# EAGLE design USBasp (EAGLE 7.7.0)
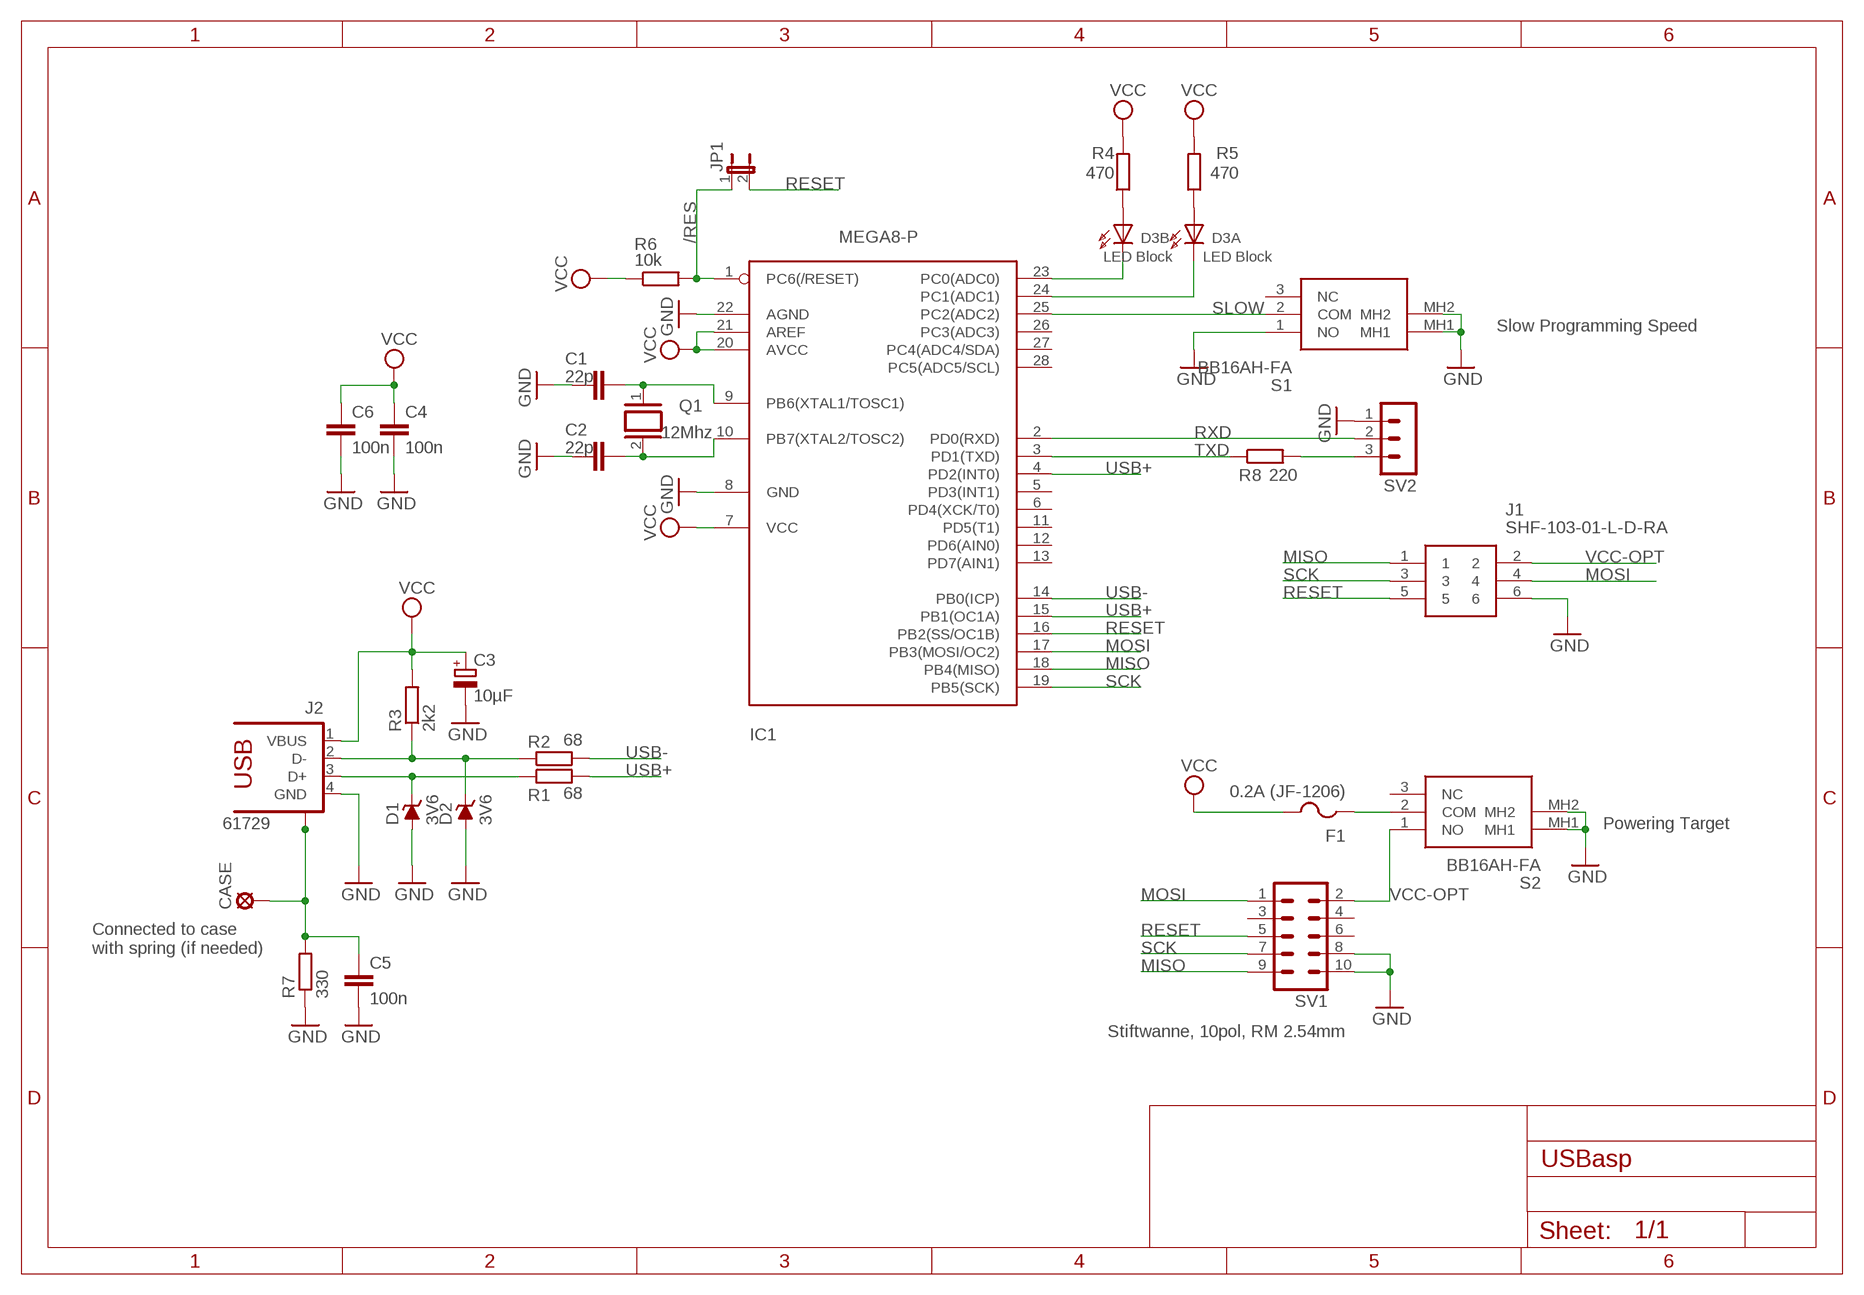
[diagram p0: schematic, sheet 1]

## Parts
C1  22p  C-EU025-024X044  [C025-024X044]
C2  22p  C-EU025-024X044  [C025-024X044]
C3  10µF  CPOL-EUE2.5-6  [E2,5-6]
C4  100n  C-EU050-024X044  [C050-024X044]
C5  100n  C-EU050-024X044  [C050-024X044]
C6  100n  C-EU050-024X044  [C050-024X044]
CASE  LSP10  [LSP10]
D1  3V6  BZX55  [DO35Z10]
D2  3V6  BZX55  [DO35Z10]
D3  LED Block  1801_PINS_SWAPPED  [1801_PINS_SWAPPED]
F1  0.2A (JF-1206)  PTCFUSE-1206  [R1206]
IC1  MEGA8-P  [DIL28-3]
J1  SHF-103-01-L-D-RA  [SHF10301LDRA]
J2  61729  [61729]
JP1  JP1E  [JP1]
Q1  12Mhz  XTAL/S  [QS]
R1  68  R-EU_0207/10  [0207/10]
R2  68  R-EU_0207/10  [0207/10]
R3  2k2  R-EU_0207/10  [0207/10]
R4  470  R-EU_0207/10  [0207/10]
R5  470  R-EU_0207/10  [0207/10]
R6  10k  R-EU_0207/10  [0207/10]
R7  330  R-EU_0207/10  [0207/10]
R8  220  R-EU_R0805  [R0805]
S1  BB16AH-FA  [BB16AHFA]
S2  BB16AH-FA  [BB16AHFA]
SV1  Stiftwanne, 10pol, RM 2.54mm  ML10L  [ML10L]
SV2  MA03-1  [MA03-1]

## Nets
/RES: IC1.1(PC6(/RESET)) JP1.1 R6.2
GND: C1.1 C2.1 C3.- C4.2 C5.2 C6.2 D1.A D2.A IC1.8(GND) IC1.22(AGND) J1.6 J2.4(GND) R7.1 S1.1(NO) S1.MH1 S1.MH2 S2.MH1 S2.MH2 SV1.8 SV1.10 SV2.1
MISO: IC1.18(PB4(MISO)) J1.1 SV1.9
MOSI: IC1.17(PB3(MOSI/OC2)) J1.4 SV1.1
N$1: D3.A1(B:A) R4.1
N$2: C5.1 CASE.MP J2.S1 J2.S2 R7.2
N$3: C1.2 IC1.9(PB6(XTAL1/TOSC1)) Q1.1
N$4: C2.2 IC1.10(PB7(XTAL2/TOSC2)) Q1.2
N$5: D1.C J2.3(D+) R1.1
N$6: D2.C J2.2(D-) R2.1 R3.1
N$7: D3.A(A:A) R5.1
N$9: D3.K1(B:K) IC1.23(PC0(ADC0))
N$10: D3.K(A:K) IC1.24(PC1(ADC1))
N$12: F1.1 S2.2(COM)
N$18: R8.2 SV2.3
RESET: IC1.16(PB2(SS/OC1B)) J1.5 JP1.2 SV1.5
RXD: IC1.2(PD0(RXD)) SV2.2
SCK: IC1.19(PB5(SCK)) J1.3 SV1.7
SLOW: IC1.25(PC2(ADC2)) S1.2(COM)
TXD: IC1.3(PD1(TXD)) R8.1
USB+: IC1.4(PD2(INT0)) IC1.15(PB1(OC1A)) R1.2
USB-: IC1.14(PB0(ICP)) R2.2
VCC: C3.+ C4.1 C6.1 F1.2 IC1.7(VCC) IC1.20(AVCC) IC1.21(AREF) J2.1(VBUS) R3.2 R4.2 R5.2 R6.1
VCC-OPT: J1.2 S2.1(NO) SV1.2
Unconnected: IC1.5(PD3(INT1)) IC1.6(PD4(XCK/T0)) IC1.11(PD5(T1)) IC1.12(PD6(AIN0)) IC1.13(PD7(AIN1)) IC1.26(PC3(ADC3)) IC1.27(PC4(ADC4/SDA)) IC1.28(PC5(ADC5/SCL)) S1.3(NC) S2.3(NC) SV1.3 SV1.4 SV1.6

## Notes on the sheet
- Slow Programming Speed
- Powering Target
- Connected to case 
  with spring (if needed)

## Library data of the parts
C1 C2 C4-C6 = rcl:C-EU: CAPACITOR, European symbol
C3 = rcl:CPOL-EU: POLARIZED CAPACITOR, European symbol
CASE = solpad:LSP10: SOLDER PAD drill 1.0 mm, distributor Buerklin, 12H555
D1 D2 = diode:BZX55: Z DIODE
D3 = Mentor-FEL:1801_PINS_SWAPPED: Similar to 1801 but with Pins Anode/Kathode swapped.
F1 = adafruit:PTCFUSE: PTC fuses, resettable thermistors
IC1 = avr-1:MEGA8-P: MICROCONTROLLER 8 Kbytes FLASH 1 kbytes SRAM 512 bytes EEPROM USART 4-channel 10 bit ADC 2-channel 8 bit ADC
J1 = SamacSys_Parts:SHF-103-01-L-D-RA: CONN HEADER R/A 6POS 1.27MM Source: Datasheet <http://suddendocs.samtec.com/catalog_english/shf.pdf>; DESCRIPTION: CONN HEADER R/A 6POS 1.27MM; HEIGHT: 5.59mm; MANUFACTURER_NAME: SAMTEC; MANUFACTURER_PART_NUMBER: SHF-103-01-L-D-RA
J2 = con-usb:61729: TYPE-B Receptacle, FCI
JP1 = jumper:JP1E: JUMPER
Q1 = special:XTAL/S: CRYSTAL
R1-R8 = rcl:R-EU_: RESISTOR, European symbol
S1 S2 = SamacSys_Parts:BB16AH-FA: Pushbutton Switches ON-ON .201 BLACK CAP RIGHT ANGL PC .4VA Source: Datasheet <https://www.arrow.com/en/products/bb16ah-fa/nkk-switches>; DESCRIPTION: Pushbutton Switches ON-ON .201 BLACK CAP RIGHT ANGL PC .4VA; HEIGHT: 8.8mm; MANUFACTURER_NAME: NKK Switches; MANUFACTURER_PART_NUMBER: BB16AH-FA; MOUSER_PART_NUMBER: 633-BB16AH-FA; MOUSER_PRICE-STOCK: https://www.mouser.co.uk/ProductDetail/NKK-Switches/BB16AH-FA?qs=E3XkhTW0K2HrJGK%2FHHAprQ%3D%3D
SV1 = con-ml:ML10L: HARTING; OC_FARNELL: unknown; OC_NEWARK: unknown
SV2 = con-lstb:MA03-1: PIN HEADER; OC_FARNELL: unknown; OC_NEWARK: unknown

## Net classes
0 default: width 0.406 mm, clearance 0.127 mm

## Board
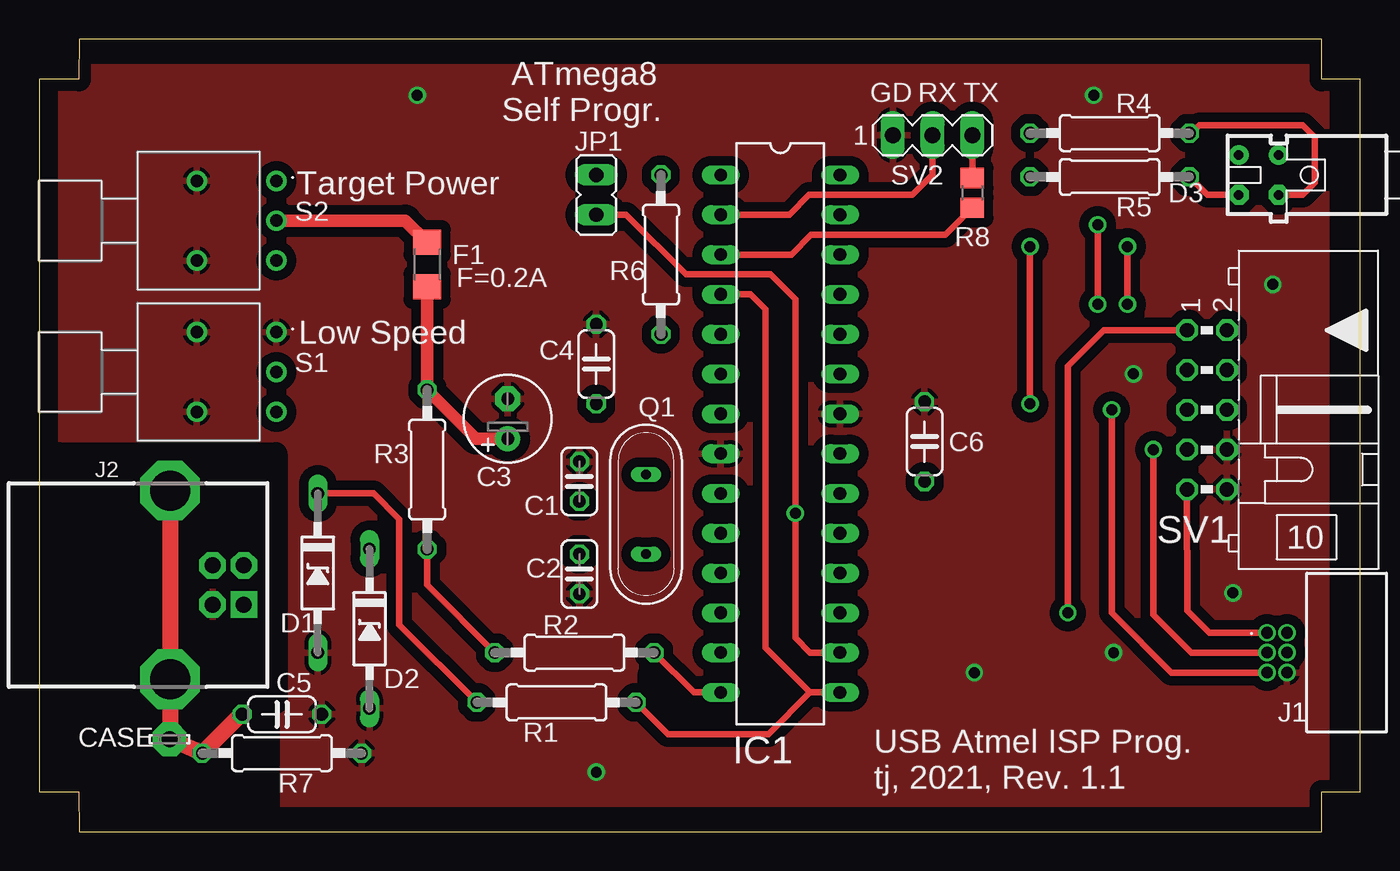
[diagram p1: board, top side]
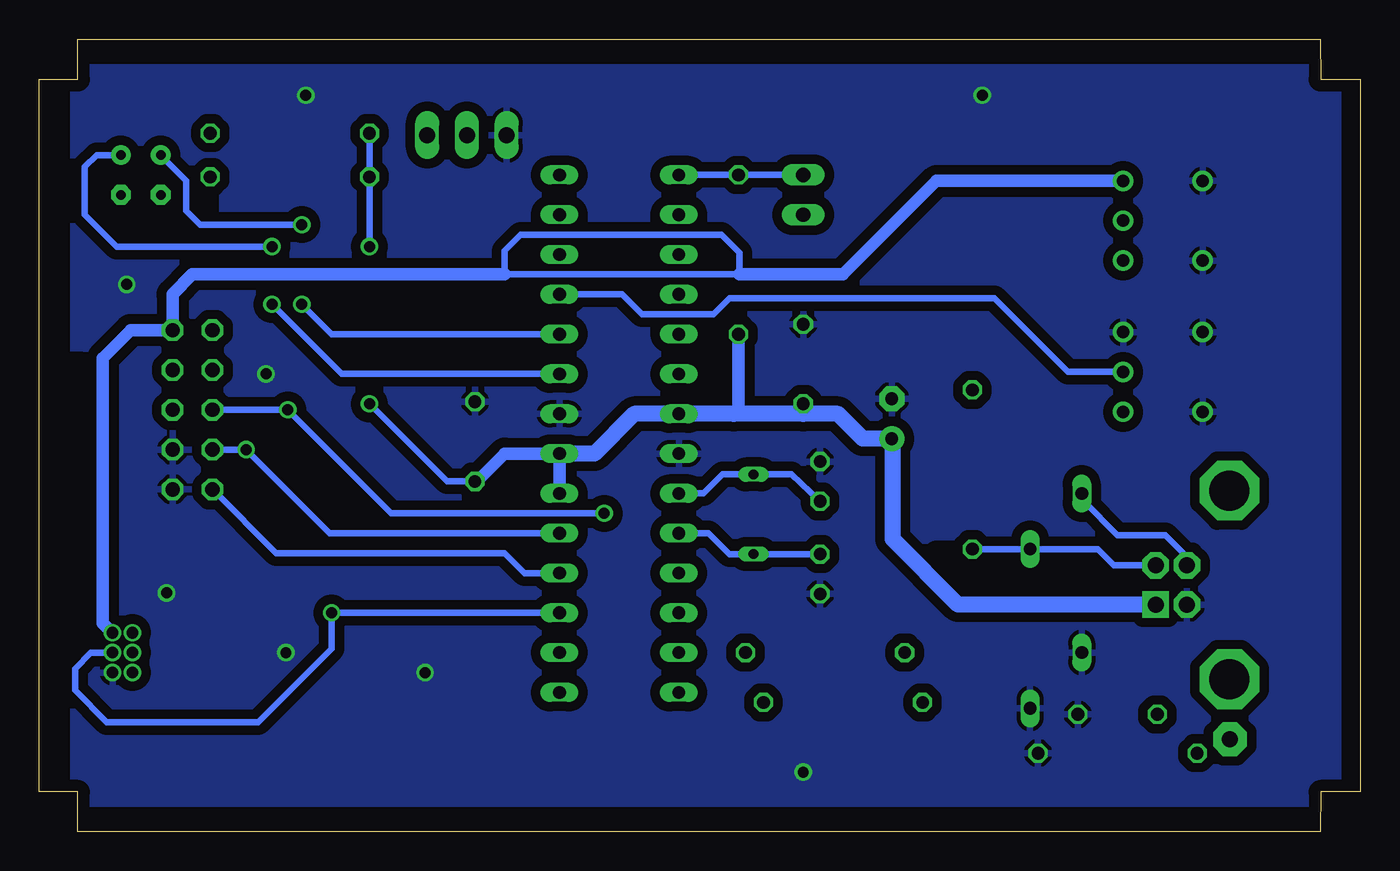
[diagram p2: board, bottom side, seen from below]

Size 84.33 x 50.57 mm. Coordinates in mm from the lower left corner, seen from the top.
Outline: 2.54,0 81.86,0 81.86,2.54 84.33,2.54 84.33,48.01 81.86,48.01 81.86,50.57 2.54,50.57 2.54,48.01 0,48.01 0,2.54 2.54,2.54 2.54,0
Copper layers (1*16): Top 0.035mm / dielectric 1.5mm / Bottom 0.035mm
Design rules "default *": minimum track width 16mil, minimum drill 24mil, track to track 8mil, track to pad 8mil, pad to pad 5mil, via to via 8mil, smd to smd 8mil, copper to edge 30mil, drill to drill 8mil, minimum pad ring 7mil, minimum via ring 8mil, stop-mask expansion 4mil, vias tented up to drill 12mil, thermal gap 10mil
tRestrict: 9 lines
bRestrict: 3 lines

### Footprints (pad centres in the part's own frame; a part is rotated, then mirrored left to right if it is on the bottom)
C025-024X044 = drill 0.813 octagon: 1 -1.27,0; 2 1.27,0
E2,5-6 = drill 0.813 pad 1.6: + -1.27,0 | drill 0.813 pad 1.6 octagon: - 1.27,0
C050-024X044 = drill 0.813 octagon: 1 -2.54,0; 2 2.54,0
LSP10 = drill 1.016 pad 2.159 octagon: MP 0,0
DO35Z10 = drill 0.813 long: A 5.08,0; C -5.08,0
1801_PINS_SWAPPED = drill 0.61 pad 1.27 octagon: A 2.54,1.27; A1 0,1.27 | drill 0.61 pad 1.27: K 2.54,-1.27; K1 0,-1.27
R1206 = smd 1.6 x 1.803: 1 -1.422,0; 2 1.422,0
DIL28-3 = drill 0.813 long: 1 -16.51,-3.81; 2 -13.97,-3.81; 3 -11.43,-3.81; 4 -8.89,-3.81; 5 -6.35,-3.81; 6 -3.81,-3.81; 7 -1.27,-3.81; 8 1.27,-3.81; 9 3.81,-3.81; 10 6.35,-3.81; 11 8.89,-3.81; 12 11.43,-3.81; 13 13.97,-3.81; 14 16.51,-3.81; 15 16.51,3.81; 16 13.97,3.81; 17 11.43,3.81; 18 8.89,3.81; 19 6.35,3.81; 20 3.81,3.81; 21 1.27,3.81; 22 -1.27,3.81; 23 -3.81,3.81; 24 -6.35,3.81; 25 -8.89,3.81; 26 -11.43,3.81; 27 -13.97,3.81; 28 -16.51,3.81
SHF10301LDRA = drill 0.74 pad 1.1: 1 0,0; 2 0,1.27; 3 1.27,0; 4 1.27,1.27; 5 2.54,0; 6 2.54,1.27
61729 = drill 1.016 pad 1.676 square: 1 1.25,1 | drill 1.016 pad 1.676 octagon: 2 -1.25,1; 3 -1.25,-1; 4 1.25,-1 | drill 2.54 pad 3.81 octagon: S1 -6.02,-3.71; S2 6.02,-3.71
JP1 = drill 0.914 long: 1 0,-1.27; 2 0,1.27
QS = drill 0.61 long: 1 -2.54,0; 2 2.54,0
0207/10 = drill 0.813 octagon: 1 -5.08,0; 2 5.08,0
R0805 = smd 1.3 x 1.5: 1 -0.95,0; 2 0.95,0
BB16AHFA = drill 0.8 pad 1.3: 1 0,0; 2 2.54,0; 3 5.08,0; MH1 0,-5.08; MH2 5.08,-5.08
ML10L = drill 0.914 octagon: 1 -5.08,-1.27; 2 -5.08,1.27; 3 -2.54,-1.27; 4 -2.54,1.27; 5 0,-1.27; 6 0,1.27; 7 2.54,-1.27; 8 2.54,1.27; 9 5.08,-1.27; 10 5.08,1.27
MA03-1 = drill 1.016 long: 1 -2.54,0; 2 0,0; 3 2.54,0

### Placement (x,y rotation side)
C1  34.48,22.35 270 top
C2  34.48,16.45 90 top
C3  29.91,26.35 90 top
C4  35.56,29.84 90 top
C5  15.49,7.49 0 top
C6  56.52,24.89 90 top
CASE  8.32,5.91 0 top
D1  17.78,16.51 270 top
D2  21.08,12.95 270 top
D3  79.11,41.91 180 top
F1  24.77,36.2 270 top
IC1  47.31,25.4 270 top
J1  78.38,12.7 270 top
J2  12.06,15.75 270 top
JP1  35.56,40.64 180 top
Q1  38.73,20.26 270 top
R1  33.02,8.26 0 top
R2  34.16,11.43 0 top
R3  24.77,23.11 90 top
R4  68.33,44.58 180 top
R5  68.33,41.78 180 top
R6  39.69,36.83 90 top
R7  15.49,5.02 180 top
R8  59.56,40.77 90 top
S1  15.14,31.88 270 top
S2  15.14,41.53 270 top
SV1  74.54,26.92 270 top
SV2  57.02,44.45 0 top

### Tracks (layer width: path | path; a pad name or v marks a point on that pad's centre or on a via)
/RES
  Bottom 0.406: IC1.1 R6.2 JP1.1
GND  (via drill 0.7)
  other vias: 59.69,10.16 68.58,11.43 69.85,29.21 67.31,46.99 78.74,34.92 24.13,46.99 76.2,15.24 35.56,3.81
  pour Bottom (isolate 0.61): 1.4,48.77 82.17,48.77 82.17,1.78 1.4,1.78
  pour Top (isolate 0.61): 1.4,48.77 1.4,1.78 82.17,1.78 82.17,48.77
MISO
  Top 0.406: J1.1 74.68,12.7 73.28,14.1 SV1.9
  Bottom 0.406: IC1.18 53.34,16.51 54.61,17.78 69.22,17.78 SV1.9
MOSI  (via drill 0.7)
  Top 0.406: v65.66,13.97 65.66,29.72 67.94,32 SV1.1
  Bottom 0.406: IC1.17 v65.66,13.97 65.66,11.68 70.36,6.99 80.01,6.99 82.04,9.02 82.04,10.41 81.03,11.43 J1.4
N$1
  Top 0.406: R4.1 73.53,44.58 74.04,45.09 80.64,45.09 81.41,44.32 81.41,41.4 80.64,40.64 D3.A1
N$2
  Top 1.016: J2.S1 J2.S2 8.36,6.2 CASE.MP R7.2 12.89,7.49 C5.1
N$3
  Bottom 0.406: IC1.9 41.91,21.59 40.7,22.8 Q1.1 36.32,22.8 C1.2
N$4
  Bottom 0.406: C2.2 Q1.2 40.26,17.72 41.59,19.05 IC1.10
N$5
  Top 0.406: D1.C 21.34,21.59 22.99,19.94 22.99,13.21 R1.1
  Bottom 0.406: J2.3 11.06,17.54 12.45,18.92 15.49,18.92 17.65,21.08 D1.C
N$6
  Top 0.406: R3.1 24.77,15.75 R2.1
  Bottom 0.406: R3.1 D2.C 16.76,18.03 15.75,17.02 12.96,17.02 J2.2
N$7
  Top 0.406: R5.1 74.55,40.64 D3.A
N$9  (via drill 0.7)
  Top 0.406: v69.47,33.66 v69.47,37.34
  Bottom 0.406: IC1.23 65.02,29.21 v69.47,33.66 | v69.47,37.34 79.38,37.34 81.41,39.37 81.41,42.42 80.64,43.18 D3.K1
N$10  (via drill 0.7)
  Top 0.406: v67.56,33.66 v67.56,38.73
  Bottom 0.406: IC1.24 65.66,31.75 v67.56,33.66 | v67.56,38.73 74.04,38.73 74.93,39.62 74.93,41.54 D3.K
N$12
  Top 0.813: S2.2 23.37,38.99 F1.1
N$18
  Top 0.406: R8.2 SV2.3
RESET  (via drill 0.7)
  Top 0.406: JP1.2 37.47,39.37 41.27,35.56 46.67,35.56 48.26,33.97 v48.26,20.32 48.26,12.38 49.21,11.43 IC1.16 | J1.5 72.26,10.16 68.45,13.97 v68.45,26.92
  Bottom 0.406: SV1.5 v68.45,26.92 61.85,20.32 v48.26,20.32
RXD
  Top 0.406: IC1.2 47.88,39.37 49.15,40.64 55.75,40.64 57.02,41.91 SV2.2
SCK  (via drill 0.7)
  Top 0.406: J1.3 73.53,11.43 71.12,13.84 v71.12,24.38
  Bottom 0.406: SV1.7 v71.12,24.38 65.79,19.05 IC1.19
SLOW
  Bottom 0.406: IC1.25 47.12,34.29 45.85,33.02 41.27,33.02 40.26,34.04 23.37,34.04 18.67,29.34 S1.2
TXD
  Top 0.406: IC1.3 48.01,36.83 49.28,38.1 57.85,38.1 R8.1
USB+
  Top 0.406: 49.21,8.89 IC1.15 | IC1.4 45.4,34.29 46.35,33.34 46.35,11.75 49.21,8.89 | R1.2 40.13,6.22 46.55,6.22 49.21,8.89
USB-
  Top 0.406: R2.2 41.78,8.89 IC1.14
VCC  (via drill 0.7)
  Top 0.406: v63.25,37.34 v63.25,27.3
  Top 0.813: F1.2 R3.2 27.88,25.08 C3.+
  Bottom 0.406: R4.2 R5.2 v63.25,37.34 | v63.25,27.3 58.29,22.35 C6.1
  Bottom 0.813: IC1.20 IC1.21 54.61,24.13 56.39,22.35 C6.1 | R6.1 39.69,26.99 40.01,26.67
  Bottom 1.016: IC1.21 48.9,24.13 46.35,26.67 IC1.7 40.01,26.67 35.56,26.67 | 35.56,26.67 33.34,26.67 31.75,25.08 C3.+ 29.84,25.02 29.84,18.67 25.67,14.5 J2.1 | C4.1 35.56,26.67
VCC-OPT
  Bottom 0.406: 39.62,35.56 54.61,35.56 54.61,37.08 53.59,38.1 40.77,38.1 39.62,36.96 39.62,35.56
  Bottom 0.813: 39.62,35.56 33.02,35.56 27.05,41.53 S2.1 | 54.61,35.56 74.55,35.56 75.82,34.29 SV1.2 78.49,32 80.26,30.23 80.26,13.29 J1.2

### Text on the board
tPlace: GD | RX | TX | ATmega8 / Self Progr. | Target Power | F=0.2A | Low Speed | USB Atmel ISP Prog. / tj, 2021, Rev. 1.1